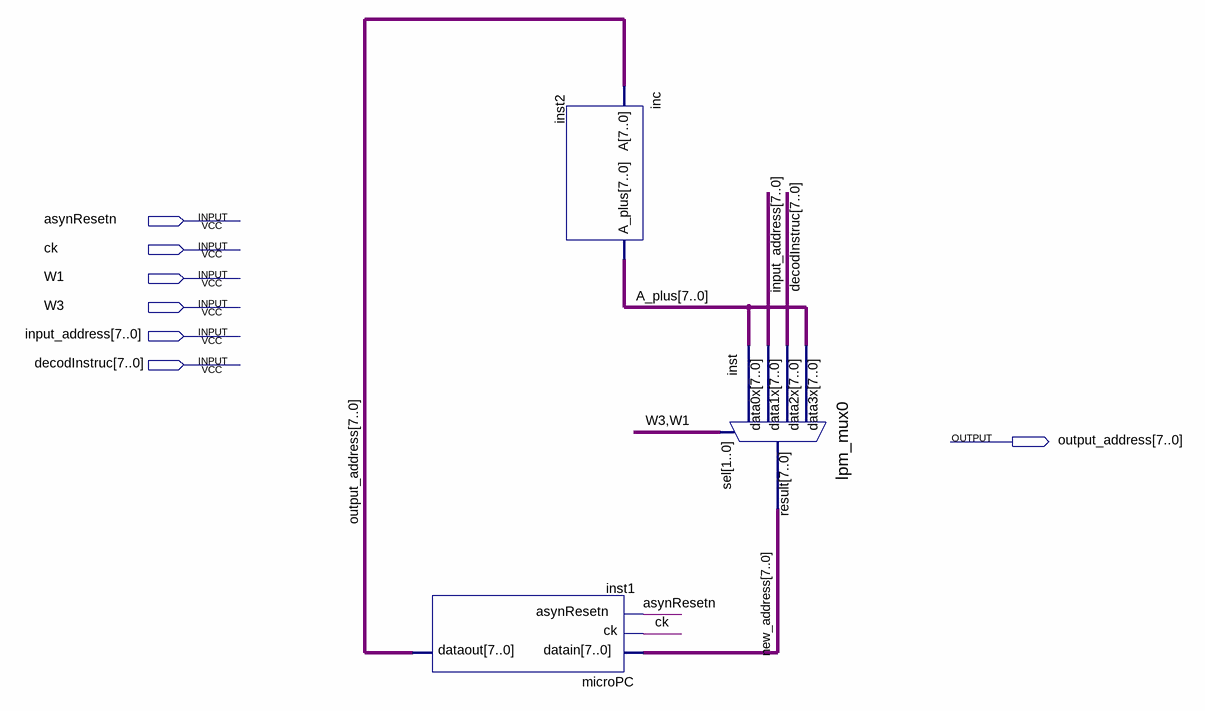
[diagram p0: schematic sheet]
// Quartus schematic sequencer.bdf as structural Verilog: 3 symbols, 7 pins
module sequencer (
  input  asynResetn,
  input  ck,
  input  W1,
  input  W3,
  input  [7:0] input_address,
  input  [7:0] decodInstruc,
  output [7:0] output_address
);

  wire [7:0] A_plus, new_address;

  microPC inst1 (.datain(new_address), .ck(ck), .asynResetn(asynResetn), .dataout(output_address));
  inc inst2 (.A(output_address), .A_plus(A_plus));
  lpm_mux0 inst (
    .data3x(A_plus), .data2x(decodInstruc), .data1x(input_address), .data0x(A_plus), .sel({W3, W1}),
    .result(new_address));
endmodule
